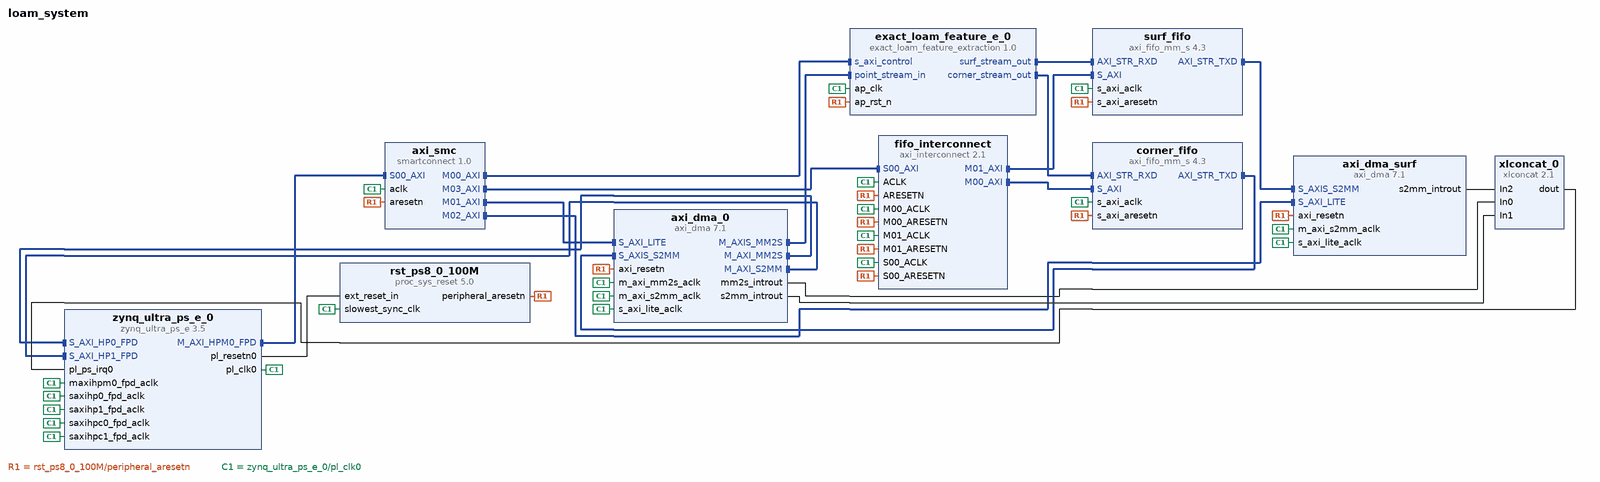
[diagram p0: block diagram of the top level]
# Vivado block design loam_system, xck26-sfvc784-2LV-c, Vivado 2024.2
create_bd_design loam_system

create_bd_cell -type ip -vlnv xilinx.com:ip:zynq_ultra_ps_e:3.5 zynq_ultra_ps_e_0
set_property -dict [list \
  CONFIG.PSU__CRL_APB__PL0_REF_CTRL__FREQMHZ 100 \
  CONFIG.PSU__DDR_HIGH_ADDRESS_GUI_ENABLE 0 \
  CONFIG.PSU__FPGA_PL0_ENABLE 1 \
  CONFIG.PSU__MAXIGP0__DATA_WIDTH 128 \
  CONFIG.PSU__USE__IRQ0 1 \
  CONFIG.PSU__USE__IRQ1 1 \
  CONFIG.PSU__USE__M_AXI_GP0 1 \
  CONFIG.PSU__USE__M_AXI_GP1 0 \
  CONFIG.PSU__USE__M_AXI_GP2 0 \
  CONFIG.PSU__USE__S_AXI_GP0 1 \
  CONFIG.PSU__USE__S_AXI_GP1 1 \
  CONFIG.PSU__USE__S_AXI_GP2 1 \
  CONFIG.PSU__USE__S_AXI_GP3 1 \
] [get_bd_cells zynq_ultra_ps_e_0]
# 38 more settings of zynq_ultra_ps_e_0 are not shown: defaults, MIO pin electricals, DDR timing, and values the tool derives
create_bd_cell -type ip -vlnv xilinx.com:hls:exact_loam_feature_extraction:1.0 exact_loam_feature_e_0
create_bd_cell -type ip -vlnv xilinx.com:ip:axi_dma:7.1 axi_dma_0
set_property -dict [list \
  CONFIG.c_include_mm2s 1 \
  CONFIG.c_include_s2mm 1 \
  CONFIG.c_include_sg 0 \
  CONFIG.c_m_axi_mm2s_data_width 128 \
  CONFIG.c_m_axi_s2mm_data_width 128 \
  CONFIG.c_m_axis_mm2s_tdata_width 128 \
  CONFIG.c_mm2s_burst_size 16 \
  CONFIG.c_s2mm_burst_size 16 \
  CONFIG.c_s_axis_s2mm_tdata_width 128 \
] [get_bd_cells axi_dma_0]
create_bd_cell -type ip -vlnv xilinx.com:ip:axi_dma:7.1 axi_dma_surf
set_property -dict [list \
  CONFIG.c_include_mm2s 0 \
  CONFIG.c_include_s2mm 1 \
  CONFIG.c_include_sg 0 \
  CONFIG.c_m_axi_s2mm_data_width 128 \
  CONFIG.c_s2mm_burst_size 16 \
  CONFIG.c_s_axis_s2mm_tdata_width 128 \
] [get_bd_cells axi_dma_surf]
create_bd_cell -type ip -vlnv xilinx.com:ip:smartconnect:1.0 axi_smc
set_property -dict [list \
  CONFIG.ADVANCED_PROPERTIES {__experimental_features__ { disable_low_area_mode 1 }} \
  CONFIG.NUM_MI 4 \
  CONFIG.NUM_SI 1 \
] [get_bd_cells axi_smc]
create_bd_cell -type ip -vlnv xilinx.com:ip:proc_sys_reset:5.0 rst_ps8_0_100M
create_bd_cell -type ip -vlnv xilinx.com:ip:axi_fifo_mm_s:4.3 corner_fifo
set_property -dict [list \
  CONFIG.C_DATA_INTERFACE_TYPE 1 \
  CONFIG.C_HAS_AXIS_TKEEP false \
  CONFIG.C_HAS_AXIS_TSTRB false \
  CONFIG.C_RX_FIFO_DEPTH 2048 \
  CONFIG.C_RX_FIFO_PF_THRESHOLD 512 \
  CONFIG.C_TX_FIFO_DEPTH 2048 \
  CONFIG.C_TX_FIFO_PF_THRESHOLD 512 \
  CONFIG.C_USE_RX_DATA 1 \
  CONFIG.C_USE_TX_CTRL 0 \
  CONFIG.C_USE_TX_DATA 1 \
] [get_bd_cells corner_fifo]
create_bd_cell -type ip -vlnv xilinx.com:ip:axi_fifo_mm_s:4.3 surf_fifo
set_property -dict [list \
  CONFIG.C_DATA_INTERFACE_TYPE 1 \
  CONFIG.C_HAS_AXIS_TKEEP false \
  CONFIG.C_HAS_AXIS_TSTRB false \
  CONFIG.C_RX_FIFO_DEPTH 2048 \
  CONFIG.C_RX_FIFO_PF_THRESHOLD 512 \
  CONFIG.C_TX_FIFO_DEPTH 2048 \
  CONFIG.C_TX_FIFO_PF_THRESHOLD 512 \
  CONFIG.C_USE_RX_DATA 1 \
  CONFIG.C_USE_TX_CTRL 0 \
  CONFIG.C_USE_TX_DATA 1 \
] [get_bd_cells surf_fifo]
create_bd_cell -type ip -vlnv xilinx.com:ip:axi_interconnect:2.1 fifo_interconnect
set_property -dict {CONFIG.NUM_MI 2 CONFIG.NUM_SI 1} [get_bd_cells fifo_interconnect]
create_bd_cell -type ip -vlnv xilinx.com:ip:xlconcat:2.1 xlconcat_0
set_property -dict {CONFIG.NUM_PORTS 3} [get_bd_cells xlconcat_0]

# ---- connections ----

connect_bd_intf_net [get_bd_intf_pins axi_dma_0/M_AXIS_MM2S] [get_bd_intf_pins exact_loam_feature_e_0/point_stream_in]
connect_bd_intf_net [get_bd_intf_pins axi_dma_0/M_AXI_MM2S] [get_bd_intf_pins zynq_ultra_ps_e_0/S_AXI_HP0_FPD]
connect_bd_intf_net [get_bd_intf_pins axi_dma_0/M_AXI_S2MM] [get_bd_intf_pins zynq_ultra_ps_e_0/S_AXI_HP1_FPD]
connect_bd_intf_net [get_bd_intf_pins axi_smc/M00_AXI] [get_bd_intf_pins exact_loam_feature_e_0/s_axi_control]
connect_bd_intf_net [get_bd_intf_pins axi_smc/M01_AXI] [get_bd_intf_pins axi_dma_0/S_AXI_LITE]
connect_bd_intf_net [get_bd_intf_pins axi_smc/M02_AXI] [get_bd_intf_pins axi_dma_surf/S_AXI_LITE]
connect_bd_intf_net [get_bd_intf_pins axi_smc/M03_AXI] [get_bd_intf_pins fifo_interconnect/S00_AXI]
connect_bd_intf_net [get_bd_intf_pins corner_fifo/AXI_STR_TXD] [get_bd_intf_pins axi_dma_0/S_AXIS_S2MM]
connect_bd_intf_net [get_bd_intf_pins exact_loam_feature_e_0/corner_stream_out] [get_bd_intf_pins corner_fifo/AXI_STR_RXD]
connect_bd_intf_net [get_bd_intf_pins exact_loam_feature_e_0/surf_stream_out] [get_bd_intf_pins surf_fifo/AXI_STR_RXD]
connect_bd_intf_net [get_bd_intf_pins fifo_interconnect/M00_AXI] [get_bd_intf_pins corner_fifo/S_AXI]
connect_bd_intf_net [get_bd_intf_pins fifo_interconnect/M01_AXI] [get_bd_intf_pins surf_fifo/S_AXI]
connect_bd_intf_net [get_bd_intf_pins surf_fifo/AXI_STR_TXD] [get_bd_intf_pins axi_dma_surf/S_AXIS_S2MM]
connect_bd_intf_net [get_bd_intf_pins zynq_ultra_ps_e_0/M_AXI_HPM0_FPD] [get_bd_intf_pins axi_smc/S00_AXI]
connect_bd_net [get_bd_pins axi_dma_0/mm2s_introut] [get_bd_pins xlconcat_0/In0]
connect_bd_net [get_bd_pins axi_dma_0/s2mm_introut] [get_bd_pins xlconcat_0/In1]
connect_bd_net [get_bd_pins axi_dma_surf/s2mm_introut] [get_bd_pins xlconcat_0/In2]
connect_bd_net [get_bd_pins rst_ps8_0_100M/peripheral_aresetn] \
  [get_bd_pins exact_loam_feature_e_0/ap_rst_n] [get_bd_pins axi_dma_0/axi_resetn] [get_bd_pins axi_dma_surf/axi_resetn] \
  [get_bd_pins axi_smc/aresetn] [get_bd_pins corner_fifo/s_axi_aresetn] [get_bd_pins surf_fifo/s_axi_aresetn] \
  [get_bd_pins fifo_interconnect/ARESETN] [get_bd_pins fifo_interconnect/S00_ARESETN] \
  [get_bd_pins fifo_interconnect/M00_ARESETN] [get_bd_pins fifo_interconnect/M01_ARESETN]
connect_bd_net [get_bd_pins xlconcat_0/dout] [get_bd_pins zynq_ultra_ps_e_0/pl_ps_irq0]
connect_bd_net [get_bd_pins zynq_ultra_ps_e_0/pl_clk0] \
  [get_bd_pins exact_loam_feature_e_0/ap_clk] [get_bd_pins axi_dma_0/s_axi_lite_aclk] [get_bd_pins axi_dma_0/m_axi_mm2s_aclk] \
  [get_bd_pins axi_dma_0/m_axi_s2mm_aclk] [get_bd_pins axi_dma_surf/s_axi_lite_aclk] \
  [get_bd_pins axi_dma_surf/m_axi_s2mm_aclk] [get_bd_pins axi_smc/aclk] [get_bd_pins rst_ps8_0_100M/slowest_sync_clk] \
  [get_bd_pins corner_fifo/s_axi_aclk] [get_bd_pins surf_fifo/s_axi_aclk] [get_bd_pins fifo_interconnect/ACLK] \
  [get_bd_pins fifo_interconnect/S00_ACLK] [get_bd_pins fifo_interconnect/M00_ACLK] [get_bd_pins fifo_interconnect/M01_ACLK] \
  [get_bd_pins zynq_ultra_ps_e_0/maxihpm0_fpd_aclk] [get_bd_pins zynq_ultra_ps_e_0/saxihp0_fpd_aclk] \
  [get_bd_pins zynq_ultra_ps_e_0/saxihp1_fpd_aclk] [get_bd_pins zynq_ultra_ps_e_0/saxihpc0_fpd_aclk] \
  [get_bd_pins zynq_ultra_ps_e_0/saxihpc1_fpd_aclk]
connect_bd_net [get_bd_pins zynq_ultra_ps_e_0/pl_resetn0] [get_bd_pins rst_ps8_0_100M/ext_reset_in]

# ---- address map ----
assign_bd_address -offset 0x00000000 -range 2G -target_address_space [get_bd_addr_spaces axi_dma_0/Data_MM2S] [get_bd_addr_segs zynq_ultra_ps_e_0/SAXIGP2/HP0_DDR_LOW]
exclude_bd_addr_seg -offset 0xFF000000 -range 16M -target_address_space [get_bd_addr_spaces axi_dma_0/Data_MM2S] [get_bd_addr_segs zynq_ultra_ps_e_0/SAXIGP2/HP0_LPS_OCM]
assign_bd_address -offset 0x00000000 -range 2G -target_address_space [get_bd_addr_spaces axi_dma_0/Data_S2MM] [get_bd_addr_segs zynq_ultra_ps_e_0/SAXIGP3/HP1_DDR_LOW]
exclude_bd_addr_seg -offset 0xFF000000 -range 16M -target_address_space [get_bd_addr_spaces axi_dma_0/Data_S2MM] [get_bd_addr_segs zynq_ultra_ps_e_0/SAXIGP3/HP1_LPS_OCM]
assign_bd_address -offset 0x00A0000000 -range 64K -target_address_space [get_bd_addr_spaces zynq_ultra_ps_e_0/Data] [get_bd_addr_segs axi_dma_0/S_AXI_LITE/Reg]
assign_bd_address -offset 0x00A0010000 -range 64K -target_address_space [get_bd_addr_spaces zynq_ultra_ps_e_0/Data] [get_bd_addr_segs axi_dma_surf/S_AXI_LITE/Reg]
assign_bd_address -offset 0x00A0020000 -range 4K -target_address_space [get_bd_addr_spaces zynq_ultra_ps_e_0/Data] [get_bd_addr_segs corner_fifo/S_AXI/Mem0]
assign_bd_address -offset 0x00A0021000 -range 4K -target_address_space [get_bd_addr_spaces zynq_ultra_ps_e_0/Data] [get_bd_addr_segs surf_fifo/S_AXI/Mem0]
assign_bd_address -offset 0x00A0030000 -range 64K -target_address_space [get_bd_addr_spaces zynq_ultra_ps_e_0/Data] [get_bd_addr_segs exact_loam_feature_e_0/s_axi_control/Reg]

validate_bd_design
save_bd_design
